# Altium schematic sheet Tilt-MCU.SchDoc
size A3; Author: Yaokun/Felix Zhang; Organization: Altium Limited; Address1: 21A144; Address2: Harbin Engineering University; Address3: Harbin; Address4: CHINA
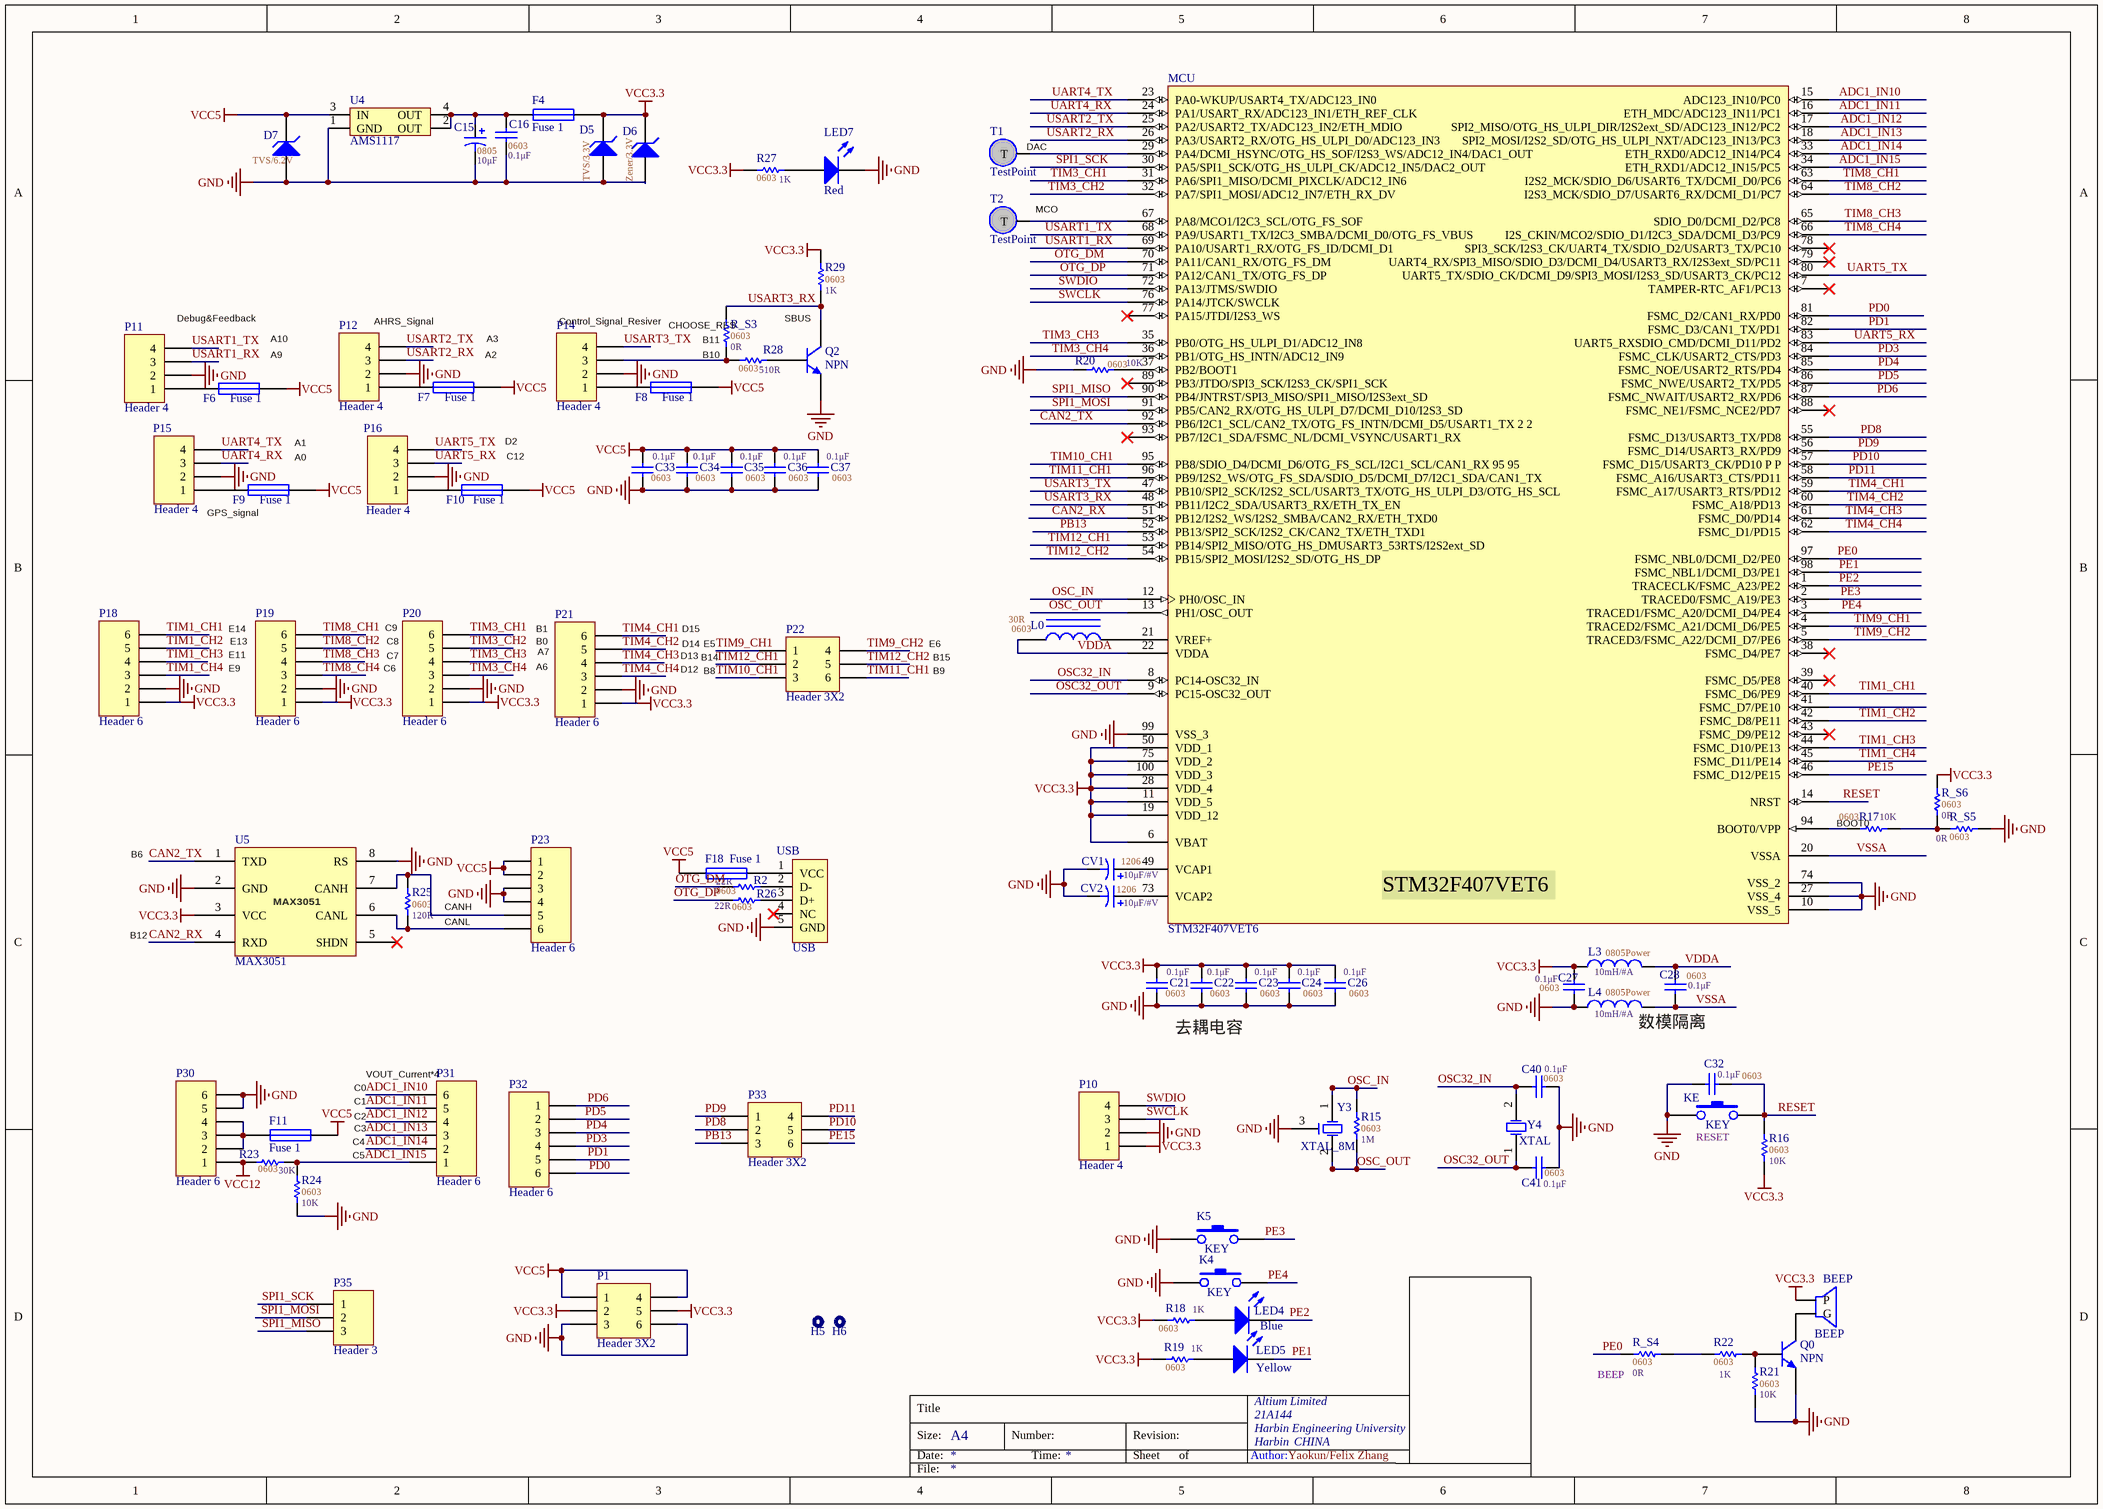
[diagram p0: Tilt-MCU.SchDoc]

## Parts
BEEP  BEEP  [BELL-5]
C15  value 10μF  PackageReference: 0805  [CAP_0805_20*12]  (hidden comment: Polar)
C16  value 0.1μF  [CAP_0603_16*08]  (hidden comment: 0603)
C21  value 0.1μF  [CAP_0603_16*08]  (hidden comment: 0603)
C22  value 0.1μF  [CAP_0603_16*08]  (hidden comment: 0603)
C23  value 0.1μF  [CAP_0603_16*08]  (hidden comment: 0603)
C24  value 0.1μF  [CAP_0603_16*08]  (hidden comment: 0603)
C26  value 0.1μF  [CAP_0603_16*08]  (hidden comment: 0603)
C27  value 0.1μF  [CAP_0603_16*08]  (hidden comment: 0603)
C28  value 0.1μF  [CAP_0603_16*08]  (hidden comment: 0603)
C32  value 0.1μF  [CAP_0603_16*08]  (hidden comment: 0603)
C33  value 0.1μF  [CAP_0603_16*08]  (hidden comment: 0603)
C34  value 0.1μF  [CAP_0603_16*08]  (hidden comment: 0603)
C35  value 0.1μF  [CAP_0603_16*08]  (hidden comment: 0603)
C36  value 0.1μF  [CAP_0603_16*08]  (hidden comment: 0603)
C37  value 0.1μF  [CAP_0603_16*08]  (hidden comment: 0603)
C40  value 0.1μF  [CAP_0603_16*08]  (hidden comment: 0603)
C41  value 0.1μF  [CAP_0603_16*08]  (hidden comment: 0603)
CV1  value 10μF/#V  PackageReference: 1206  [CAP_0805_20*12]  (hidden comment: Polar)
CV2  value 10μF/#V  PackageReference: 1206  [CAP_0805_20*12]  (hidden comment: Polar)
D5  TVS/3.3V  [SOD523]
D6  Zener/3.3V  [SOD323]
D7  TVS/6.2V  [SOD523]
F4  Fuse 1  [RES_0805_20*12]
F6  Fuse 1  [RES_0805_20*12]
F7  Fuse 1  [RES_0805_20*12]
F8  Fuse 1  [RES_0805_20*12]
F9  Fuse 1  [RES_0805_20*12]
F10  Fuse 1  [RES_0805_20*12]
F11  Fuse 1  [FUSE3.5*5.5]
F18  Fuse 1  [RES_0805_20*12]
H5  pad  [PAD_M2]  (value not drawn)
H6  pad  [PAD_M2]  (value not drawn)
K4  KEY  [KEY_2]
K5  KEY  [KEY_2]
KE  KEY  [KEY_2]
L0  value 30R  PackageDescription: 0603  [IND_0603_16*08]  (hidden comment: Inductor Iron)
L3  value 10mH/#A  PackageReference: 0805  PackageDescription: Power  [IND_0603_16*08]  (hidden comment: MODEL?)
L4  value 10mH/#A  PackageReference: 0805  PackageDescription: Power  [IND_0603_16*08]  (hidden comment: MODEL?)
LED4  Blue  [LED0603]
LED5  Yellow  [LED0603]
LED7  Red  [LED0603]
MCU  STM32F407VET6  [LQFP100_1]
P1  Header 3X2  [HEADER2*3_PIN]
P10  Header 4  [Modolex_4P]
P11  Header 4  [Modolex_4P]
P12  Header 4  [Modolex_4P]
P14  Header 4  [Modolex_4P]
P15  Header 4  [Modolex_4P]
P16  Header 4  [Modolex_4P]
P18  Header 6  [Modolex_6P]
P19  Header 6  [Modolex_6P]
P20  Header 6  [Modolex_6P]
P21  Header 6  [Modolex_6P]
P22  Header 3X2  [HEADER2*3_PIN]
P23  Header 6  [Modolex_6P]
P30  Header 6  [Modolex_6P]
P31  Header 6  [Modolex_6P]
P32  Header 6  [Modolex_6P]
P33  Header 3X2  [HEADER2*3_PIN]
P35  Header 3  [HEADER1*3_PIN]
Q0  NPN  [SOT23_J3Y]
Q2  NPN  [SOT23_J3Y]
R2  value 22R  PackageReference: 0603  [RES_0603_16*08]  (hidden comment: SMD)
R15  value 1M  PackageReference: 0603  [RES_0805_20*12]  (hidden comment: SMD)
R16  value 10K  PackageReference: 0603  [RES_0603_16*08]  (hidden comment: SMD)
R17  value 10K  PackageReference: 0603  [RES_0603_16*08]  (hidden comment: SMD)
R18  value 1K  PackageReference: 0603  [RES_0603_16*08]  (hidden comment: SMD)
R19  value 1K  PackageReference: 0603  [RES_0603_16*08]  (hidden comment: SMD)
R20  value 10K  PackageReference: 0603  [RES_0603_16*08]  (hidden comment: SMD)
R21  value 10K  PackageReference: 0603  [RES_0603_16*08]  (hidden comment: SMD)
R22  value 1K  PackageReference: 0603  [RES_0603_16*08]  (hidden comment: SMD)
R23  value 30K  PackageReference: 0603  [RES_0805_20*12]  (hidden comment: SMD)
R24  value 10K  PackageReference: 0603  [RES_0805_20*12]  (hidden comment: SMD)
R25  value 120R  PackageReference: 0603  [RES_0805_20*12]  (hidden comment: SMD)
R26  value 22R  PackageReference: 0603  [RES_0603_16*08]  (hidden comment: SMD)
R27  value 1K  PackageReference: 0603  [RES_0603_16*08]  (hidden comment: SMD)
R28  value 510R  PackageReference: 0603  [RES_0603_16*08]  (hidden comment: SMD)
R29  value 1K  PackageReference: 0603  [RES_0603_16*08]  (hidden comment: SMD)
R_S3  value 0R  PackageReference: 0603  [RES_0402_10*06]  (hidden comment: SMD)
R_S4  value 0R  PackageReference: 0603  [RES_0402_10*06]  (hidden comment: SMD)
R_S5  value 0R  PackageReference: 0603  [RES_0402_10*06]  (hidden comment: SMD)
R_S6  value 0R  PackageReference: 0603  [RES_0402_10*06]  (hidden comment: SMD)
T1  TestPoint  [TestPoint]
T2  TestPoint  [TestPoint]
U4  AMS1117  [SOT223_M]
U5  MAX3051  [SO8_M]
USB  USB  [USB_micro_S]
Y3  XTAL_8M  [XTAL_SMD_8M]
Y4  XTAL  [XTAL32]

## Nets
GND: C15.2 C16.1 C21.2 C22.2 C23.2 C24.2 C26.2 C27.1 C32.1 C33.2 C34.2 C35.2 C36.2 C37.2 C40.2 C41.2 CV1.2 CV2.2 D5.1(A) D6.1(A) D7.1(A) K4.1 K5.1 KE.1 L4.1 LED7.2(K) MCU.10(VSS_5) MCU.27(VSS_4) MCU.74(VSS_2) MCU.99(VSS_3) P1.3 P1.6 P10.2 P11.2 P12.2 P14.2 P15.2 P16.2 P18.2 P19.2 P20.2 P21.2 P23.3 P23.4 P30.5 P30.6 Q0.3(E) Q2.3(E) R20.1 R21.1 R24.1 R_S5.1 U4.1(GND) U5.2(GND) U5.8(RS) USB.5(GND) Y3.3(OSC3)
VCC3.3: BEEP.1(P) C21.1 C22.1 C23.1 C24.1 C26.1 C27.2 D5.2(K) D6.2(K) F4.2 L3.1 MCU.6(VBAT) MCU.11(VDD_5) MCU.19(VDD_12) MCU.28(VDD_4) MCU.50(VDD_1) MCU.75(VDD_2) MCU.100(VDD_3) P1.2 P1.5 P10.1 P18.1 P19.1 P20.1 P21.1 R16.1 R18.1 R19.1 R27.1 R29.2 R_S6.1 U5.3(VCC)
VCC5: C33.1 C34.1 C35.1 C36.1 C37.1 D7.2(K) F6.2 F7.2 F8.2 F9.2 F10.2 F11.2 F18.2 P1.1 P1.4 P23.1 P23.2 U4.3(IN)
VCC12: P30.1 R23.1
ADC1_IN10: MCU.15(ADC123_IN10/PC0) P31.6
ADC1_IN11: MCU.16(ETH_MDC/ADC123_IN11/PC1) P31.5
ADC1_IN12: MCU.17(SPI2_MISO/OTG_HS_ULPI_DIR/I2S2ext_SD/ADC123_IN12/PC2) P31.4
ADC1_IN13: MCU.18(SPI2_MOSI/I2S2_SD/OTG_HS_ULPI_NXT/ADC123_IN13/PC3) P31.3
ADC1_IN14: MCU.33(ETH_RXD0/ADC12_IN14/PC4) P31.2
ADC1_IN15: MCU.34(ETH_RXD1/ADC12_IN15/PC5) P31.1 R23.2 R24.2
CAN2_RX: MCU.51(PB12/I2S2_WS/I2S2_SMBA/CAN2_RX/ETH_TXD0) U5.4(RXD)
CAN2_TX: MCU.92(PB6/I2C1_SCL/CAN2_TX/OTG_FS_INTN/DCMI_D5/USART1_TX_2_2) U5.1(TXD)
OSC32_IN: C40.1 MCU.8(PC14-OSC32_IN) Y4.2(OSC2)
OSC32_OUT: C41.1 MCU.9(PC15-OSC32_OUT) Y4.1(OSC1)
OSC_IN: MCU.12(PH0/OSC_IN) R15.2 Y3.1(OSC1)
OSC_OUT: MCU.13(PH1/OSC_OUT) R15.1 Y3.2(OSC2)
OTG_DM: MCU.70(PA11/CAN1_RX/OTG_FS_DM) R2.1
OTG_DP: MCU.71(PA12/CAN1_TX/OTG_FS_DP) R26.1
PB13: MCU.52(PB13/SPI2_SCK/I2S2_CK/CAN2_TX/ETH_TXD1) P33.3
PD0: MCU.81(FSMC_D2/CAN1_RX/PD0) P32.6
PD1: MCU.82(FSMC_D3/CAN1_TX/PD1) P32.5
PD3: MCU.84(FSMC_CLK/USART2_CTS/PD3) P32.4
PD4: MCU.85(FSMC_NOE/USART2_RTS/PD4) P32.3
PD5: MCU.86(FSMC_NWE/USART2_TX/PD5) P32.2
PD6: MCU.87(FSMC_NWAIT/USART2_RX/PD6) P32.1
PD8: MCU.55(FSMC_D13/USART3_TX/PD8) P33.2
PD9: MCU.56(FSMC_D14/USART3_RX/PD9) P33.1
PD10: MCU.57(FSMC_D15/USART3_CK/PD10_P_P) P33.5
PD11: MCU.58(FSMC_A16/USART3_CTS/PD11) P33.4
PE0: MCU.97(FSMC_NBL0/DCMI_D2/PE0) R_S4.2
PE1: LED5.2(K) MCU.98(FSMC_NBL1/DCMI_D3/PE1)
PE2: LED4.2(K) MCU.1(TRACECLK/FSMC_A23/PE2)
PE3: K5.2 MCU.2(TRACED0/FSMC_A19/PE3)
PE4: K4.2 MCU.3(TRACED1/FSMC_A20/DCMI_D4/PE4)
PE15: MCU.46(FSMC_D12/PE15) P33.6
RESET: C32.2 KE.2 MCU.14(NRST) R16.2
SPI1_MISO: MCU.90(PB4/JNTRST/SPI3_MISO/SPI1_MISO/I2S3ext_SD) P35.3
SPI1_MOSI: MCU.91(PB5/CAN2_RX/OTG_HS_ULPI_D7/DCMI_D10/I2S3_SD) P35.2
SPI1_SCK: MCU.30(PA5/SPI1_SCK/OTG_HS_ULPI_CK/ADC12_IN5/DAC2_OUT) P35.1
SWCLK: MCU.76(PA14/JTCK/SWCLK) P10.3
SWDIO: MCU.72(PA13/JTMS/SWDIO) P10.4
TIM1_CH1: MCU.40(FSMC_D6/PE9) P18.6
TIM1_CH2: MCU.42(FSMC_D8/PE11) P18.5
TIM1_CH3: MCU.44(FSMC_D10/PE13) P18.4
TIM1_CH4: MCU.45(FSMC_D11/PE14) P18.3
TIM3_CH1: MCU.31(PA6/SPI1_MISO/DCMI_PIXCLK/ADC12_IN6) P20.6
TIM3_CH2: MCU.32(PA7/SPI1_MOSI/ADC12_IN7/ETH_RX_DV) P20.5
TIM3_CH3: MCU.35(PB0/OTG_HS_ULPI_D1/ADC12_IN8) P20.4
TIM3_CH4: MCU.36(PB1/OTG_HS_INTN/ADC12_IN9) P20.3
TIM4_CH1: MCU.59(FSMC_A17/USART3_RTS/PD12) P21.6
TIM4_CH2: MCU.60(FSMC_A18/PD13) P21.5
TIM4_CH3: MCU.61(FSMC_D0/PD14) P21.4
TIM4_CH4: MCU.62(FSMC_D1/PD15) P21.3
TIM8_CH1: MCU.63(I2S2_MCK/SDIO_D6/USART6_TX/DCMI_D0/PC6) P19.6
TIM8_CH2: MCU.64(I2S3_MCK/SDIO_D7/USART6_RX/DCMI_D1/PC7) P19.5
TIM8_CH3: MCU.65(SDIO_D0/DCMI_D2/PC8) P19.4
TIM8_CH4: MCU.66(I2S_CKIN/MCO2/SDIO_D1/I2C3_SDA/DCMI_D3/PC9) P19.3
TIM9_CH1: MCU.4(TRACED2/FSMC_A21/DCMI_D6/PE5) P22.1
TIM9_CH2: MCU.5(TRACED3/FSMC_A22/DCMI_D7/PE6) P22.4
TIM10_CH1: MCU.95(PB8/SDIO_D4/DCMI_D6/OTG_FS_SCL/I2C1_SCL/CAN1_RX_95_95) P22.3
TIM11_CH1: MCU.96(PB9/I2S2_WS/OTG_FS_SDA/SDIO_D5/DCMI_D7/I2C1_SDA/CAN1_TX) P22.6
TIM12_CH1: MCU.53(PB14/SPI2_MISO/OTG_HS_DMUSART3_53RTS/I2S2ext_SD) P22.2
TIM12_CH2: MCU.54(PB15/SPI2_MOSI/I2S2_SD/OTG_HS_DP) P22.5
UART4_RX: MCU.24(PA1/USART_RX/ADC123_IN1/ETH_REF_CLK) P15.3
UART4_TX: MCU.23(PA0-WKUP/USART4_TX/ADC123_IN0) P15.4
UART5_RX: MCU.83(UART5_RXSDIO_CMD/DCMI_D11/PD2) P16.3
UART5_TX: MCU.80(UART5_TX/SDIO_CK/DCMI_D9/SPI3_MOSI/I2S3_SD/USART3_CK/PC12) P16.4
USART1_RX: MCU.69(PA10/USART1_RX/OTG_FS_ID/DCMI_D1) P11.3
USART1_TX: MCU.68(PA9/USART1_TX/I2C3_SMBA/DCMI_D0/OTG_FS_VBUS) P11.4
USART2_RX: MCU.26(PA3/USART2_RX/OTG_HS_ULPI_D0/ADC123_IN3) P12.3
USART2_TX: MCU.25(PA2/USART2_TX/ADC123_IN2/ETH_MDIO) P12.4
USART3_RX: MCU.48(PB11/I2C2_SDA/USART3_RX/ETH_TX_EN) Q2.1(C) R29.1 R_S3.2
USART3_TX: MCU.47(PB10/SPI2_SCK/I2S2_SCL/USART3_TX/OTG_HS_ULPI_D3/OTG_HS_SCL) P14.4
VDDA: C28.2 L0.1 L3.2 MCU.22(VDDA)
VSSA: C28.1 L4.2 MCU.20(VSSA)
NetBEEP_2: BEEP.2(G) Q0.1(C)
NetC15_1: C15.1 C16.2 F4.1 U4.2(OUT) U4.4(OUT)
NetCV1_1: CV1.1 MCU.49(VCAP1)
NetCV2_1: CV2.1 MCU.73(VCAP2)
NetF6_1: F6.1 P11.1
NetF7_1: F7.1 P12.1
NetF8_1: F8.1 P14.1
NetF9_1: F9.1 P15.1
NetF10_1: F10.1 P16.1
NetF11_1: F11.1 P30.2 P30.3 P30.4
NetF18_1: F18.1 USB.1(VCC)
NetL0_2: L0.2 MCU.21(VREF+)
NetLED4_1: LED4.1(A) R18.2
NetLED5_1: LED5.1(A) R19.2
NetLED7_1: LED7.1(A) R27.2
NetMCU_29: MCU.29(PA4/DCMI_HSYNC/OTG_HS_SOF/I2S3_WS/ADC12_IN4/DAC1_OUT) T1.1(T)
NetMCU_37: MCU.37(PB2/BOOT1) R20.2
NetMCU_67: MCU.67(PA8/MCO1/I2C3_SCL/OTG_FS_SOF) T2.1(T)
NetMCU_94: MCU.94(BOOT0/VPP) R17.2
NetP14_3: P14.3 R28.1 R_S3.1
NetP23_5: P23.5 R25.2 U5.7(CANH)
NetP23_6: P23.6 R25.1 U5.6(CANL)
NetQ0_2: Q0.2(B) R21.2 R22.2
NetQ2_2: Q2.2(B) R28.2
NetR2_2: R2.2 USB.2(D-)
NetR17_1: R17.1 R_S5.2 R_S6.2
NetR22_1: R22.1 R_S4.1
NetR26_2: R26.2 USB.3(D+)

Not connected (* = marked no-connect by the designer): MCU 7(TAMPER-RTC_AF1/PC13)* 38(FSMC_D4/PE7)* 39(FSMC_D5/PE8)* 41(FSMC_D7/PE10) 43(FSMC_D9/PE12)* 77(PA15/JTDI/I2S3_WS)* 78(SPI3_SCK/I2S3_CK/UART4_TX/SDIO_D2/USART3_TX/PC10)* 79(UART4_RX/SPI3_MISO/SDIO_D3/DCMI_D4/USART3_RX/I2S3ext_SD/PC11)* 88(FSMC_NE1/FSMC_NCE2/PD7)* 89(PB3/JTDO/SPI3_SCK/I2S3_CK/SPI1_SCK)* 93(PB7/I2C1_SDA/FSMC_NL/DCMI_VSYNC/USART1_RX)*; U5 5(SHDN)*; USB 4(NC)*

## Notes on the sheet
- (near T1) DAC
- (near T2) MCO
- (near P11) Debug&Feedback
- (near F6) A9
- (near F6) A10
- (near P12) AHRS_Signal
- (near F7) A2
- (near F7) A3
- (near P14) Control_Signal_Resiver
- (near R_S3) CHOOSE_RES
- (near R_S3) B10
- (near R_S3) B11
- SBUS
- A1
- D2
- GPS_signal
- (near F9) A0
- (near F10) C12
- (near P19) E14
- (near P19) E13
- (near P20) C9
- (near P20) C8
- (near P21) B0
- (near P21) B1
- (near P21) A7
- D14
- D15
- E5
- E6
- E9
- (near P19) E11
- (near P20) C6
- (near P20) C7
- (near P21) A6
- D12
- D13
- B14
- B8
- B9
- B15
- B6
- (near R17) BOOT0
- (near R25) CANH
- (near R25) CANL
- B12
- 去耦电容
- (near L4) 数模隔离
- C0
- C1
- (near F11) C2
- (near P31) VOUT_Current*4
- C4
- C5
- (near F11) C3
- (near R_S4) BEEP
- Title
- Size:
- Date:
- A4
- Number:
- Time:
- Revision:
- Sheet
- of
- Author:
- File:
- (in symbol KEY) RESET

## Library data of the parts
C15 CV1 CV2 = Cap Pol: Polarized Capacitor (Axial); LatestRevisionDate: 17-Jul-2002; LatestRevisionNote: Re-released for DXP Platform.; Publisher: Altium Limited; Published: 1206; PackageDescription: Polar
C16 C21-C24 C26-C28 C32-C37 C40 C41 = Cap: Capacitor; Published: 8-Jun-2000; LatestRevisionDate: 17-Jul-2002; LatestRevisionNote: Re-released for DXP Platform.; Publisher: Altium Limited; PackageDescription: 0603; PackageReference: 0603
D5-D7 = D Zener: Zener Diode; Published: 8-Jun-2000; LatestRevisionDate: 17-Jul-2002; LatestRevisionNote: Re-released for DXP Platform.; PackageReference: DIODE-0.7; Publisher: Altium Limited; PackageDescription: Diode, Thru-Hole; 2 Leads; 0.7 in Pin Spacing
F4 F6-F11 F18 = Fuse 1: Fuse; Published: 8-Jun-2000; LatestRevisionDate: 17-Jul-2002; LatestRevisionNote: Re-released for DXP Platform.; PackageReference: PIN-W2/E2.8; Publisher: Altium Limited; PackageDescription: Thru-Hole; 2 Leads
L0 = Inductor Iron: Magnetic-Core Inductor; Published: 24-Mar-1999; LatestRevisionDate: 17-Jul-2002; LatestRevisionNote: Re-released for DXP Platform.; PackageReference: AXIAL-0.9; Publisher: Altium Limited
L3 L4 = Inductor: Code_IEC: 1005; Published: 8-Jun-2000; LatestRevisionDate: 29-May-2009; LatestRevisionNote: IPC-7351 Footprint Added.; Publisher: Altium Limited; Code_JEITA: 0402
LED4 LED5 LED7 = LED: Typical RED, GREEN, YELLOW, AMBER GaAs LED; Published: 8-Jun-2000; LatestRevisionDate: 17-Jul-2002; LatestRevisionNote: Re-released for DXP Platform.; PackageVersion: Feb-2002; PackageReference: 3.2X1.6X1.1; Publisher: Altium Limited; PackageDescription: SM LED; 2 Flat Leads
P1 P22 P33 = Header 3X2: Header, 3-Pin, Dual row; LatestRevisionDate: 17-Jul-2002; LatestRevisionNote: Re-released for DXP Platform.; Publisher: Altium Limited
P10-P12 P14-P16 = Header 4: Header, 4-Pin; LatestRevisionDate: 17-Jul-2002; LatestRevisionNote: Re-released for DXP Platform.; Publisher: Altium Limited
P18-P21 P23 P30-P32 = Header 6: Header, 6-Pin; LatestRevisionDate: 17-Jul-2002; LatestRevisionNote: Re-released for DXP Platform.; Publisher: Altium Limited
P35 = Header 3: Header, 3-Pin; LatestRevisionDate: 17-Jul-2002; LatestRevisionNote: Re-released for DXP Platform.; Publisher: Altium Limited
Q0 Q2 = NPN: NPN Bipolar Transistor; Published: 8-Jun-2000; LatestRevisionDate: 17-Jul-2002; LatestRevisionNote: Re-released for DXP Platform.; PackageReference: TO-226-AA; Publisher: Altium Limited; PackageDescription: TO, Flat Index; 3 In-Line, Axial Leads; Body Dia. 4.8mm; Leads 0.55 x 0.51 mm (max); Code_JEDEC: TO-226-AA
R2 R15-R29 R_S3-R_S6 = RES_SMD: Resistor; Published: 8-Jun-2000; LatestRevisionDate: 17-Jul-2002; LatestRevisionNote: Re-released for DXP Platform.; Publisher: Altium Limited; PackageDescription: SMD
USB = USB5
Y4 = XTAL: Crystal Oscillator; Published: 8-Jun-2000; LatestRevisionDate: 17-Jul-2002; LatestRevisionNote: Re-released for DXP Platform.; PackageReference: R38; Publisher: Altium Limited; PackageDescription: Crystal, Thru-Hole; 2 Leads; Body 3.1 x 8.2 mm (Dia.xH)